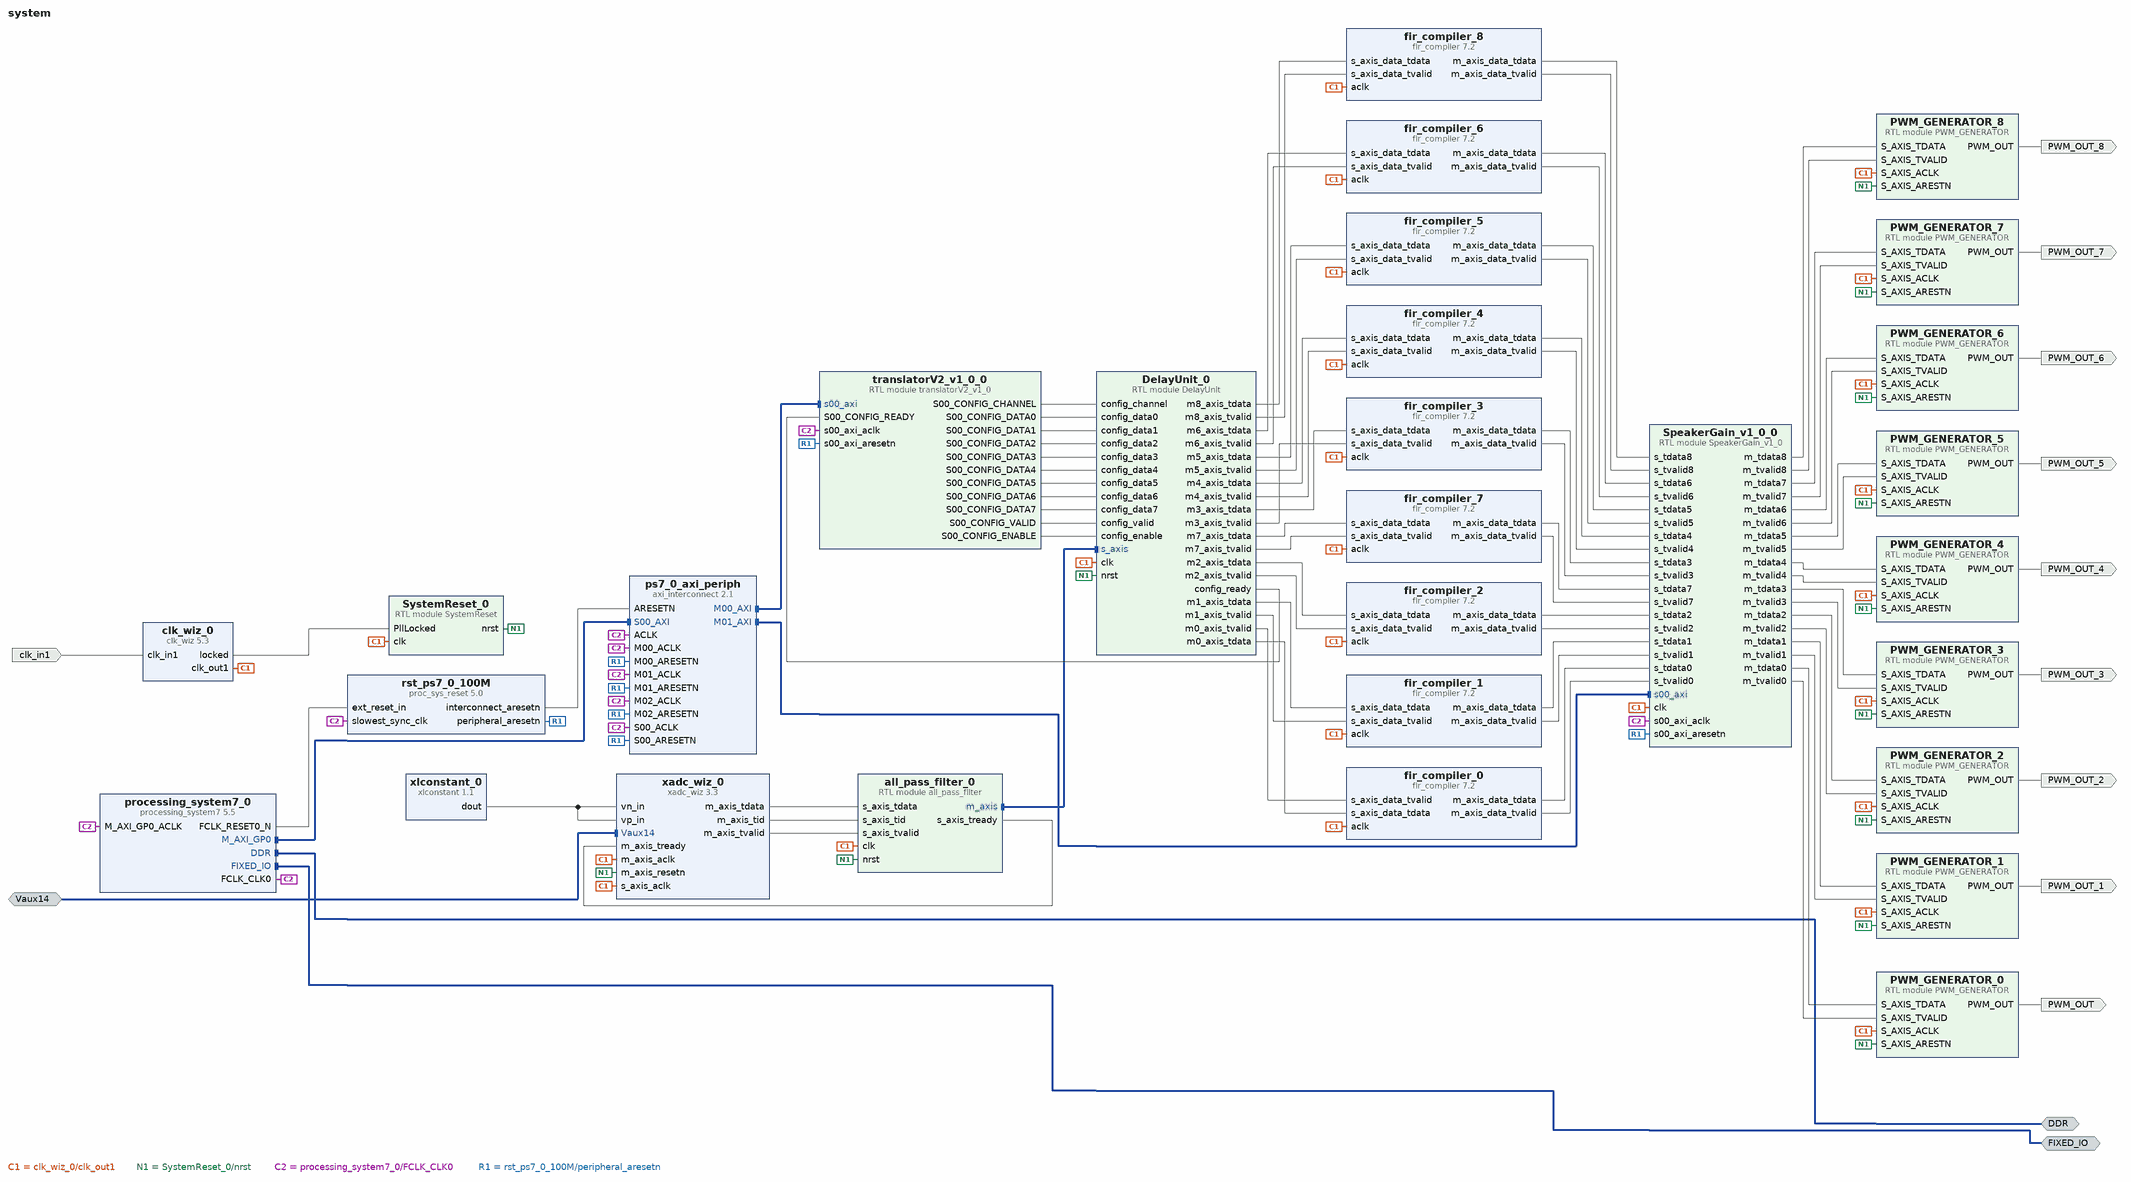
[diagram p0: block diagram of the top level]
# Vivado block design system, xc7z010clg400-1, Vivado 2016.4
create_bd_design system

create_bd_intf_port -mode Slave -vlnv xilinx.com:interface:diff_analog_io_rtl:1.0 Vaux14
create_bd_intf_port -mode Master -vlnv xilinx.com:interface:ddrx_rtl:1.0 DDR
create_bd_intf_port -mode Master -vlnv xilinx.com:display_processing_system7:fixedio_rtl:1.0 FIXED_IO
create_bd_port -dir I -type clk clk_in1
set_property -dict {CONFIG.FREQ_HZ 125000000} [get_bd_ports clk_in1]
create_bd_port -dir O PWM_OUT
create_bd_port -dir O PWM_OUT_1
create_bd_port -dir O PWM_OUT_2
create_bd_port -dir O PWM_OUT_3
create_bd_port -dir O PWM_OUT_4
create_bd_port -dir O PWM_OUT_5
create_bd_port -dir O PWM_OUT_6
create_bd_port -dir O PWM_OUT_7
create_bd_port -dir O PWM_OUT_8

create_bd_cell -type ip -vlnv xilinx.com:ip:xadc_wiz:3.3 xadc_wiz_0
set_property -dict [list \
  CONFIG.INTERFACE_SELECTION None \
  CONFIG.XADC_STARUP_SELECTION single_channel \
  CONFIG.DCLK_FREQUENCY 200 \
  CONFIG.ADC_CONVERSION_RATE 248 \
  CONFIG.SEQUENCER_MODE Off \
  CONFIG.ENABLE_CALIBRATION_AVERAGING false \
  CONFIG.ENABLE_RESET true \
  CONFIG.OT_ALARM false \
  CONFIG.USER_TEMP_ALARM false \
  CONFIG.VCCINT_ALARM false \
  CONFIG.VCCAUX_ALARM false \
  CONFIG.ENABLE_VCCPINT_ALARM false \
  CONFIG.ENABLE_VCCPAUX_ALARM false \
  CONFIG.ENABLE_VCCDDRO_ALARM false \
  CONFIG.SINGLE_CHANNEL_SELECTION VAUXP14_VAUXN14 \
  CONFIG.BIPOLAR_OPERATION false \
  CONFIG.SINGLE_CHANNEL_ACQUISITION_TIME false \
  CONFIG.ADC_OFFSET_AND_GAIN_CALIBRATION false \
  CONFIG.SENSOR_OFFSET_AND_GAIN_CALIBRATION false \
  CONFIG.EXTERNAL_MUX_CHANNEL VP_VN \
  CONFIG.ACQUISITION_TIME 4 \
  CONFIG.ENABLE_AXI4STREAM true \
] [get_bd_cells xadc_wiz_0]
create_bd_cell -type ip -vlnv xilinx.com:ip:clk_wiz:5.3 clk_wiz_0
set_property -dict [list \
  CONFIG.PRIMITIVE MMCM \
  CONFIG.USE_FREQ_SYNTH true \
  CONFIG.USE_PHASE_ALIGNMENT true \
  CONFIG.SECONDARY_SOURCE Single_ended_clock_capable_pin \
  CONFIG.CLKOUT1_REQUESTED_OUT_FREQ 200.000 \
  CONFIG.CLKOUT1_DRIVES BUFG \
  CONFIG.CLKOUT2_DRIVES BUFG \
  CONFIG.CLKOUT3_DRIVES BUFG \
  CONFIG.CLKOUT4_DRIVES BUFG \
  CONFIG.CLKOUT5_DRIVES BUFG \
  CONFIG.CLKOUT6_DRIVES BUFG \
  CONFIG.CLKOUT7_DRIVES BUFG \
  CONFIG.FEEDBACK_SOURCE FDBK_AUTO \
  CONFIG.USE_RESET false \
  CONFIG.OVERRIDE_MMCM false \
  CONFIG.MMCM_DIVCLK_DIVIDE 1 \
  CONFIG.MMCM_CLKFBOUT_MULT_F 8.000 \
  CONFIG.MMCM_CLKIN1_PERIOD 8.0 \
  CONFIG.MMCM_COMPENSATION ZHOLD \
  CONFIG.MMCM_CLKOUT0_DIVIDE_F 5.000 \
  CONFIG.CLKOUT1_JITTER 109.241 \
] [get_bd_cells clk_wiz_0]
create_bd_cell -type module -reference SystemReset SystemReset_0
create_bd_cell -type ip -vlnv xilinx.com:ip:xlconstant:1.1 xlconstant_0
create_bd_cell -type ip -vlnv xilinx.com:ip:fir_compiler:7.2 fir_compiler_1
set_property -dict [list \
  CONFIG.CoefficientVector {-0.000019041352741156416 0.0000029301914172371256 -3.6768483344507386e-7 -0.000003836551719568998 0.0000089002153275909 -0.000013674289108198891 0.00001687867604394857 -0.000017414023842576747 0.000014676634210476724 -0.000008795358390444727 7.128819105705863e-7 0.000007935685536875149 -0.000015143911555678856 0.000018994233996533387 -0.000018159172550968502 0.000012320896878708027 -0.000002381896379509973 -0.00000961278827549694 0.00002085069067935666 -0.000028375067438131785 0.00002982488349525296 -0.00002409549462988192 0.000011775667406554418 0.000004815964472440209 -0.000022017142099311243 0.000035602648801606694 -0.00004178881667839474 0.00003823817140914734 -0.000024804300939030065 0.0000038009191332509773 0.000020324054683538727 -0.00004188484963479359 0.00005526003825210053 -0.00005630910283599139 0.00004355618163140338 -0.00001882106383873046 -0.000012916540292147349 0.00004446020068207575 -0.00006798358521103809 0.00007692330651883338 -0.00006773262611607378 0.00004103870839226485 -0.0000018657423637850393 -0.00004122346939754801 0.00007794070152751594 -0.00009867798645794731 0.00009695074600652638 -0.0000712740123096432 0.00002595377645999454 0.00002949238856375895 -0.00008226028436258929 0.00011915525272199847 -0.00012982426630453567 0.00010954353145808946 -0.00006083592716046003 -0.000006577921938697168 0.00007761369495879302 -0.00013512636399127574 0.00016397831140467593 -0.00015492303020613014 0.00010732822916677011 -0.000029977455998076163 -0.000060389702304865136 0.00014260943181627756 -0.00019597233057583395 0.00020534581566300345 -0.0001652924648154562 0.00008209811231394558 0.000026943107875943244 -0.00013699642264337886 0.0002212563919353774 -0.0002573785668981639 0.0002332664572832073 -0.00015072856067744784 0.00002597552537061006 0.00011338200778125975 -0.00023433460933799656 0.00030619328717149287 -0.0003082472952060473 0.00023547945676466372 -0.00010080610094428376 -0.00006693052334588403 0.00022899293911600365 -0.0003455829437492202 0.0003854916247275692 -0.00033425274515994086 0.00019870910604078955 -0.000006658430774636147 -0.00019865526948053224 0.00036812077411889306 -0.00045842886639016017 0.00044290006258003705 -0.00031904194597501376 0.00011055520030152633 0.00013690183445902196 -0.0003655284207684386 0.0005187460956651649 -0.0005550450411802359 0.00045894329190607983 -0.00024623122381175046 -0.00003809196545489699 0.00032910643855402823 -0.0005566358186483607 0.0006620092212486477 -0.0006129490878703415 0.000412866742113862 -0.00010199446400902006 -0.00025038361038967014 0.0005611766143858198 -0.000752886866353166 0.0007727448729063266 -0.0006068037274486477 0.000285402152189655 0.00012186420381940452 -0.0005209502675615812 0.0008148830648118401 -0.000927111401184166 0.0008211132778651532 -0.0005113083051929379 0.00006217994826840372 0.00042478615163802166 -0.0008337961224003981 0.0010620594062415226 -0.0010453293884840442 0.0007753879505194565 -0.0003048332203720656 -0.00026261871449624515 0.0007946914764836736 -0.0011611358169578943 0.001265327944517681 -0.0010692865771081712 0.0006057168928571574 0.000026454030352946215 -0.0006827811996767003 0.0012060110963551744 -0.001463465580379262 0.0013802783639488365 -0.0009602480456305384 0.0002886719666866497 0.0004843764460821107 -0.0011772163823039593 0.0016189314187674752 -0.0016911405391928495 0.0013590476420805226 -0.0006837659311763557 -0.0001879366403568961 0.001055048470092471 -0.0017082830453966236 0.0019801847790092454 -0.00178746835249378 0.0011550154624745768 -0.00021488679690375242 -0.0008205604635378981 0.0017061639938962749 -0.0022215477806558125 0.0022253920315775558 -0.0016931423818874328 0.0007283117327795006 0.00045656720809545976 -0.0015861312278179077 0.0023856422122774156 -0.0026472043694480796 0.002282928601030838 -0.0013516370243227976 0.00005146471444394643 0.0013214224397132847 -0.002439616082358894 0.0030218574914216236 -0.002902896014769223 0.002078661821290235 -0.0007147483828981013 -0.0008855344708581879 0.002347723236253159 -0.003312984703577437 0.0035252018947944533 -0.0028974501488159957 0.001540921273714806 0.00025240314181401604 -0.0020713711716555602 0.003478833760551589 -0.004115557011655544 0.003790381411309153 -0.0025343796397941333 0.0006042660364119146 0.0015682223012447494 -0.003471446694985796 0.0046328698858826315 -0.004734607870994604 0.0036976715952429674 -0.0017131556686796991 -0.0007897654369456328 0.00323458754818787 -0.005028264031319931 0.005702795480762143 -0.005034312827249552 0.003110036006499024 -0.000324401561407994 -0.002698546280621569 0.005242307521669369 -0.006664316925323021 0.006554634985456841 -0.004847773456292042 0.00185889288891883 0.001768812358652028 -0.005198174297073603 0.007586561313611442 -0.00828738248289196 0.0070176106157153785 -0.003949538006207436 -0.00029973359509665945 0.004785183827492607 -0.00843656194118727 0.010304886403581508 -0.009797818712967612 0.006847933216103021 -0.001969729285972992 -0.00381599402551681 0.009182645210259754 -0.012786220998971368 0.013581726659228514 -0.011097099530066386 0.005598466976258024 0.0018998658268226426 -0.009796117828864628 0.016211116133106475 -0.019391983704541534 0.018129046529705935 -0.012096747430613189 0.002039067855966391 0.010252823544402932 -0.022183134769247614 0.030781921979053262 -0.0332506388488356 0.02752223341332959 -0.012726642971133252 -0.010534473584759027 0.04016715744605928 -0.07283552166567399 0.10444838811776436 -0.13080126193355354 0.14826105101766904 0.8356296512233774 0.14826105101766904 -0.13080126193355354 0.10444838811776436 -0.07283552166567399 0.04016715744605928 -0.010534473584759027 -0.012726642971133252 0.02752223341332959 -0.0332506388488356 0.030781921979053262 -0.022183134769247614 0.010252823544402932 0.002039067855966391 -0.012096747430613189 0.018129046529705935 -0.019391983704541534 0.016211116133106475 -0.009796117828864628 0.0018998658268226426 0.005598466976258024 -0.011097099530066386 0.013581726659228514 -0.012786220998971368 0.009182645210259754 -0.00381599402551681 -0.001969729285972992 0.006847933216103021 -0.009797818712967612 0.010304886403581508 -0.00843656194118727 0.004785183827492607 -0.00029973359509665945 -0.003949538006207436 0.0070176106157153785 -0.00828738248289196 0.007586561313611442 -0.005198174297073603 0.001768812358652028 0.00185889288891883 -0.004847773456292042 0.006554634985456841 -0.006664316925323021 0.005242307521669369 -0.002698546280621569 -0.000324401561407994 0.003110036006499024 -0.005034312827249552 0.005702795480762143 -0.005028264031319931 0.00323458754818787 -0.0007897654369456328 -0.0017131556686796991 0.0036976715952429674 -0.004734607870994604 0.0046328698858826315 -0.003471446694985796 0.0015682223012447494 0.0006042660364119146 -0.0025343796397941333 0.003790381411309153 -0.004115557011655544 0.003478833760551589 -0.0020713711716555602 0.00025240314181401604 0.001540921273714806 -0.0028974501488159957 0.0035252018947944533 -0.003312984703577437 0.002347723236253159 -0.0008855344708581879 -0.0007147483828981013 0.002078661821290235 -0.002902896014769223 0.0030218574914216236 -0.002439616082358894 0.0013214224397132847 0.00005146471444394643 -0.0013516370243227976 0.002282928601030838 -0.0026472043694480796 0.0023856422122774156 -0.0015861312278179077 0.00045656720809545976 0.0007283117327795006 -0.0016931423818874328 0.0022253920315775558 -0.0022215477806558125 0.0017061639938962749 -0.0008205604635378981 -0.00021488679690375242 0.0011550154624745768 -0.00178746835249378 0.0019801847790092454 -0.0017082830453966236 0.001055048470092471 -0.0001879366403568961 -0.0006837659311763557 0.0013590476420805226 -0.0016911405391928495 0.0016189314187674752 -0.0011772163823039593 0.0004843764460821107 0.0002886719666866497 -0.0009602480456305384 0.0013802783639488365 -0.001463465580379262 0.0012060110963551744 -0.0006827811996767003 0.000026454030352946215 0.0006057168928571574 -0.0010692865771081712 0.001265327944517681 -0.0011611358169578943 0.0007946914764836736 -0.00026261871449624515 -0.0003048332203720656 0.0007753879505194565 -0.0010453293884840442 0.0010620594062415226 -0.0008337961224003981 0.00042478615163802166 0.00006217994826840372 -0.0005113083051929379 0.0008211132778651532 -0.000927111401184166 0.0008148830648118401 -0.0005209502675615812 0.00012186420381940452 0.000285402152189655 -0.0006068037274486477 0.0007727448729063266 -0.000752886866353166 0.0005611766143858198 -0.00025038361038967014 -0.00010199446400902006 0.000412866742113862 -0.0006129490878703415 0.0006620092212486477 -0.0005566358186483607 0.00032910643855402823 -0.00003809196545489699 -0.00024623122381175046 0.00045894329190607983 -0.0005550450411802359 0.0005187460956651649 -0.0003655284207684386 0.00013690183445902196 0.00011055520030152633 -0.00031904194597501376 0.00044290006258003705 -0.00045842886639016017 0.00036812077411889306 -0.00019865526948053224 -0.000006658430774636147 0.00019870910604078955 -0.00033425274515994086 0.0003854916247275692 -0.0003455829437492202 0.00022899293911600365 -0.00006693052334588403 -0.00010080610094428376 0.00023547945676466372 -0.0003082472952060473 0.00030619328717149287 -0.00023433460933799656 0.00011338200778125975 0.00002597552537061006 -0.00015072856067744784 0.0002332664572832073 -0.0002573785668981639 0.0002212563919353774 -0.00013699642264337886 0.000026943107875943244 0.00008209811231394558 -0.0001652924648154562 0.00020534581566300345 -0.00019597233057583395 0.00014260943181627756 -0.000060389702304865136 -0.000029977455998076163 0.00010732822916677011 -0.00015492303020613014 0.00016397831140467593 -0.00013512636399127574 0.00007761369495879302 -0.000006577921938697168 -0.00006083592716046003 0.00010954353145808946 -0.00012982426630453567 0.00011915525272199847 -0.00008226028436258929 0.00002949238856375895 0.00002595377645999454 -0.0000712740123096432 0.00009695074600652638 -0.00009867798645794731 0.00007794070152751594 -0.00004122346939754801 -0.0000018657423637850393 0.00004103870839226485 -0.00006773262611607378 0.00007692330651883338 -0.00006798358521103809 0.00004446020068207575 -0.000012916540292147349 -0.00001882106383873046 0.00004355618163140338 -0.00005630910283599139 0.00005526003825210053 -0.00004188484963479359 0.000020324054683538727 0.0000038009191332509773 -0.000024804300939030065 0.00003823817140914734 -0.00004178881667839474 0.000035602648801606694 -0.000022017142099311243 0.000004815964472440209 0.000011775667406554418 -0.00002409549462988192 0.00002982488349525296 -0.000028375067438131785 0.00002085069067935666 -0.00000961278827549694 -0.000002381896379509973 0.000012320896878708027 -0.000018159172550968502 0.000018994233996533387 -0.000015143911555678856 0.000007935685536875149 7.128819105705863e-7 -0.000008795358390444727 0.000014676634210476724 -0.000017414023842576747 0.00001687867604394857 -0.000013674289108198891 0.0000089002153275909 -0.000003836551719568998 -3.6768483344507386e-7 0.0000029301914172371256 -0.000019041352741156416} \
  CONFIG.Coefficient_Sets 1 \
  CONFIG.Sample_Frequency 4.8E-2 \
  CONFIG.Clock_Frequency 200 \
  CONFIG.Coefficient_Sign Signed \
  CONFIG.Quantization Quantize_Only \
  CONFIG.Coefficient_Width 13 \
  CONFIG.Coefficient_Fractional_Bits 12 \
  CONFIG.Coefficient_Structure Inferred \
  CONFIG.Data_Sign Unsigned \
  CONFIG.Output_Rounding_Mode Non_Symmetric_Rounding_Down \
  CONFIG.Output_Width 16 \
  CONFIG.Filter_Architecture Systolic_Multiply_Accumulate \
  CONFIG.M_DATA_Has_TREADY false \
  CONFIG.S_DATA_Has_FIFO false \
] [get_bd_cells fir_compiler_1]
create_bd_cell -type ip -vlnv xilinx.com:ip:fir_compiler:7.2 fir_compiler_2
set_property -dict [list \
  CONFIG.CoefficientVector {-0.000019041352741156416 0.0000029301914172371256 -3.6768483344507386e-7 -0.000003836551719568998 0.0000089002153275909 -0.000013674289108198891 0.00001687867604394857 -0.000017414023842576747 0.000014676634210476724 -0.000008795358390444727 7.128819105705863e-7 0.000007935685536875149 -0.000015143911555678856 0.000018994233996533387 -0.000018159172550968502 0.000012320896878708027 -0.000002381896379509973 -0.00000961278827549694 0.00002085069067935666 -0.000028375067438131785 0.00002982488349525296 -0.00002409549462988192 0.000011775667406554418 0.000004815964472440209 -0.000022017142099311243 0.000035602648801606694 -0.00004178881667839474 0.00003823817140914734 -0.000024804300939030065 0.0000038009191332509773 0.000020324054683538727 -0.00004188484963479359 0.00005526003825210053 -0.00005630910283599139 0.00004355618163140338 -0.00001882106383873046 -0.000012916540292147349 0.00004446020068207575 -0.00006798358521103809 0.00007692330651883338 -0.00006773262611607378 0.00004103870839226485 -0.0000018657423637850393 -0.00004122346939754801 0.00007794070152751594 -0.00009867798645794731 0.00009695074600652638 -0.0000712740123096432 0.00002595377645999454 0.00002949238856375895 -0.00008226028436258929 0.00011915525272199847 -0.00012982426630453567 0.00010954353145808946 -0.00006083592716046003 -0.000006577921938697168 0.00007761369495879302 -0.00013512636399127574 0.00016397831140467593 -0.00015492303020613014 0.00010732822916677011 -0.000029977455998076163 -0.000060389702304865136 0.00014260943181627756 -0.00019597233057583395 0.00020534581566300345 -0.0001652924648154562 0.00008209811231394558 0.000026943107875943244 -0.00013699642264337886 0.0002212563919353774 -0.0002573785668981639 0.0002332664572832073 -0.00015072856067744784 0.00002597552537061006 0.00011338200778125975 -0.00023433460933799656 0.00030619328717149287 -0.0003082472952060473 0.00023547945676466372 -0.00010080610094428376 -0.00006693052334588403 0.00022899293911600365 -0.0003455829437492202 0.0003854916247275692 -0.00033425274515994086 0.00019870910604078955 -0.000006658430774636147 -0.00019865526948053224 0.00036812077411889306 -0.00045842886639016017 0.00044290006258003705 -0.00031904194597501376 0.00011055520030152633 0.00013690183445902196 -0.0003655284207684386 0.0005187460956651649 -0.0005550450411802359 0.00045894329190607983 -0.00024623122381175046 -0.00003809196545489699 0.00032910643855402823 -0.0005566358186483607 0.0006620092212486477 -0.0006129490878703415 0.000412866742113862 -0.00010199446400902006 -0.00025038361038967014 0.0005611766143858198 -0.000752886866353166 0.0007727448729063266 -0.0006068037274486477 0.000285402152189655 0.00012186420381940452 -0.0005209502675615812 0.0008148830648118401 -0.000927111401184166 0.0008211132778651532 -0.0005113083051929379 0.00006217994826840372 0.00042478615163802166 -0.0008337961224003981 0.0010620594062415226 -0.0010453293884840442 0.0007753879505194565 -0.0003048332203720656 -0.00026261871449624515 0.0007946914764836736 -0.0011611358169578943 0.001265327944517681 -0.0010692865771081712 0.0006057168928571574 0.000026454030352946215 -0.0006827811996767003 0.0012060110963551744 -0.001463465580379262 0.0013802783639488365 -0.0009602480456305384 0.0002886719666866497 0.0004843764460821107 -0.0011772163823039593 0.0016189314187674752 -0.0016911405391928495 0.0013590476420805226 -0.0006837659311763557 -0.0001879366403568961 0.001055048470092471 -0.0017082830453966236 0.0019801847790092454 -0.00178746835249378 0.0011550154624745768 -0.00021488679690375242 -0.0008205604635378981 0.0017061639938962749 -0.0022215477806558125 0.0022253920315775558 -0.0016931423818874328 0.0007283117327795006 0.00045656720809545976 -0.0015861312278179077 0.0023856422122774156 -0.0026472043694480796 0.002282928601030838 -0.0013516370243227976 0.00005146471444394643 0.0013214224397132847 -0.002439616082358894 0.0030218574914216236 -0.002902896014769223 0.002078661821290235 -0.0007147483828981013 -0.0008855344708581879 0.002347723236253159 -0.003312984703577437 0.0035252018947944533 -0.0028974501488159957 0.001540921273714806 0.00025240314181401604 -0.0020713711716555602 0.003478833760551589 -0.004115557011655544 0.003790381411309153 -0.0025343796397941333 0.0006042660364119146 0.0015682223012447494 -0.003471446694985796 0.0046328698858826315 -0.004734607870994604 0.0036976715952429674 -0.0017131556686796991 -0.0007897654369456328 0.00323458754818787 -0.005028264031319931 0.005702795480762143 -0.005034312827249552 0.003110036006499024 -0.000324401561407994 -0.002698546280621569 0.005242307521669369 -0.006664316925323021 0.006554634985456841 -0.004847773456292042 0.00185889288891883 0.001768812358652028 -0.005198174297073603 0.007586561313611442 -0.00828738248289196 0.0070176106157153785 -0.003949538006207436 -0.00029973359509665945 0.004785183827492607 -0.00843656194118727 0.010304886403581508 -0.009797818712967612 0.006847933216103021 -0.001969729285972992 -0.00381599402551681 0.009182645210259754 -0.012786220998971368 0.013581726659228514 -0.011097099530066386 0.005598466976258024 0.0018998658268226426 -0.009796117828864628 0.016211116133106475 -0.019391983704541534 0.018129046529705935 -0.012096747430613189 0.002039067855966391 0.010252823544402932 -0.022183134769247614 0.030781921979053262 -0.0332506388488356 0.02752223341332959 -0.012726642971133252 -0.010534473584759027 0.04016715744605928 -0.07283552166567399 0.10444838811776436 -0.13080126193355354 0.14826105101766904 0.8356296512233774 0.14826105101766904 -0.13080126193355354 0.10444838811776436 -0.07283552166567399 0.04016715744605928 -0.010534473584759027 -0.012726642971133252 0.02752223341332959 -0.0332506388488356 0.030781921979053262 -0.022183134769247614 0.010252823544402932 0.002039067855966391 -0.012096747430613189 0.018129046529705935 -0.019391983704541534 0.016211116133106475 -0.009796117828864628 0.0018998658268226426 0.005598466976258024 -0.011097099530066386 0.013581726659228514 -0.012786220998971368 0.009182645210259754 -0.00381599402551681 -0.001969729285972992 0.006847933216103021 -0.009797818712967612 0.010304886403581508 -0.00843656194118727 0.004785183827492607 -0.00029973359509665945 -0.003949538006207436 0.0070176106157153785 -0.00828738248289196 0.007586561313611442 -0.005198174297073603 0.001768812358652028 0.00185889288891883 -0.004847773456292042 0.006554634985456841 -0.006664316925323021 0.005242307521669369 -0.002698546280621569 -0.000324401561407994 0.003110036006499024 -0.005034312827249552 0.005702795480762143 -0.005028264031319931 0.00323458754818787 -0.0007897654369456328 -0.0017131556686796991 0.0036976715952429674 -0.004734607870994604 0.0046328698858826315 -0.003471446694985796 0.0015682223012447494 0.0006042660364119146 -0.0025343796397941333 0.003790381411309153 -0.004115557011655544 0.003478833760551589 -0.0020713711716555602 0.00025240314181401604 0.001540921273714806 -0.0028974501488159957 0.0035252018947944533 -0.003312984703577437 0.002347723236253159 -0.0008855344708581879 -0.0007147483828981013 0.002078661821290235 -0.002902896014769223 0.0030218574914216236 -0.002439616082358894 0.0013214224397132847 0.00005146471444394643 -0.0013516370243227976 0.002282928601030838 -0.0026472043694480796 0.0023856422122774156 -0.0015861312278179077 0.00045656720809545976 0.0007283117327795006 -0.0016931423818874328 0.0022253920315775558 -0.0022215477806558125 0.0017061639938962749 -0.0008205604635378981 -0.00021488679690375242 0.0011550154624745768 -0.00178746835249378 0.0019801847790092454 -0.0017082830453966236 0.001055048470092471 -0.0001879366403568961 -0.0006837659311763557 0.0013590476420805226 -0.0016911405391928495 0.0016189314187674752 -0.0011772163823039593 0.0004843764460821107 0.0002886719666866497 -0.0009602480456305384 0.0013802783639488365 -0.001463465580379262 0.0012060110963551744 -0.0006827811996767003 0.000026454030352946215 0.0006057168928571574 -0.0010692865771081712 0.001265327944517681 -0.0011611358169578943 0.0007946914764836736 -0.00026261871449624515 -0.0003048332203720656 0.0007753879505194565 -0.0010453293884840442 0.0010620594062415226 -0.0008337961224003981 0.00042478615163802166 0.00006217994826840372 -0.0005113083051929379 0.0008211132778651532 -0.000927111401184166 0.0008148830648118401 -0.0005209502675615812 0.00012186420381940452 0.000285402152189655 -0.0006068037274486477 0.0007727448729063266 -0.000752886866353166 0.0005611766143858198 -0.00025038361038967014 -0.00010199446400902006 0.000412866742113862 -0.0006129490878703415 0.0006620092212486477 -0.0005566358186483607 0.00032910643855402823 -0.00003809196545489699 -0.00024623122381175046 0.00045894329190607983 -0.0005550450411802359 0.0005187460956651649 -0.0003655284207684386 0.00013690183445902196 0.00011055520030152633 -0.00031904194597501376 0.00044290006258003705 -0.00045842886639016017 0.00036812077411889306 -0.00019865526948053224 -0.000006658430774636147 0.00019870910604078955 -0.00033425274515994086 0.0003854916247275692 -0.0003455829437492202 0.00022899293911600365 -0.00006693052334588403 -0.00010080610094428376 0.00023547945676466372 -0.0003082472952060473 0.00030619328717149287 -0.00023433460933799656 0.00011338200778125975 0.00002597552537061006 -0.00015072856067744784 0.0002332664572832073 -0.0002573785668981639 0.0002212563919353774 -0.00013699642264337886 0.000026943107875943244 0.00008209811231394558 -0.0001652924648154562 0.00020534581566300345 -0.00019597233057583395 0.00014260943181627756 -0.000060389702304865136 -0.000029977455998076163 0.00010732822916677011 -0.00015492303020613014 0.00016397831140467593 -0.00013512636399127574 0.00007761369495879302 -0.000006577921938697168 -0.00006083592716046003 0.00010954353145808946 -0.00012982426630453567 0.00011915525272199847 -0.00008226028436258929 0.00002949238856375895 0.00002595377645999454 -0.0000712740123096432 0.00009695074600652638 -0.00009867798645794731 0.00007794070152751594 -0.00004122346939754801 -0.0000018657423637850393 0.00004103870839226485 -0.00006773262611607378 0.00007692330651883338 -0.00006798358521103809 0.00004446020068207575 -0.000012916540292147349 -0.00001882106383873046 0.00004355618163140338 -0.00005630910283599139 0.00005526003825210053 -0.00004188484963479359 0.000020324054683538727 0.0000038009191332509773 -0.000024804300939030065 0.00003823817140914734 -0.00004178881667839474 0.000035602648801606694 -0.000022017142099311243 0.000004815964472440209 0.000011775667406554418 -0.00002409549462988192 0.00002982488349525296 -0.000028375067438131785 0.00002085069067935666 -0.00000961278827549694 -0.000002381896379509973 0.000012320896878708027 -0.000018159172550968502 0.000018994233996533387 -0.000015143911555678856 0.000007935685536875149 7.128819105705863e-7 -0.000008795358390444727 0.000014676634210476724 -0.000017414023842576747 0.00001687867604394857 -0.000013674289108198891 0.0000089002153275909 -0.000003836551719568998 -3.6768483344507386e-7 0.0000029301914172371256 -0.000019041352741156416} \
  CONFIG.Coefficient_Sets 1 \
  CONFIG.Sample_Frequency 4.8E-2 \
  CONFIG.Clock_Frequency 200 \
  CONFIG.Coefficient_Sign Signed \
  CONFIG.Quantization Quantize_Only \
  CONFIG.Coefficient_Width 13 \
  CONFIG.Coefficient_Fractional_Bits 12 \
  CONFIG.Coefficient_Structure Inferred \
  CONFIG.Data_Sign Unsigned \
  CONFIG.Output_Rounding_Mode Non_Symmetric_Rounding_Down \
  CONFIG.Output_Width 16 \
  CONFIG.Filter_Architecture Systolic_Multiply_Accumulate \
  CONFIG.S_DATA_Has_FIFO false \
] [get_bd_cells fir_compiler_2]
create_bd_cell -type ip -vlnv xilinx.com:ip:fir_compiler:7.2 fir_compiler_3
set_property -dict [list \
  CONFIG.CoefficientVector {-0.000019041352741156416 0.0000029301914172371256 -3.6768483344507386e-7 -0.000003836551719568998 0.0000089002153275909 -0.000013674289108198891 0.00001687867604394857 -0.000017414023842576747 0.000014676634210476724 -0.000008795358390444727 7.128819105705863e-7 0.000007935685536875149 -0.000015143911555678856 0.000018994233996533387 -0.000018159172550968502 0.000012320896878708027 -0.000002381896379509973 -0.00000961278827549694 0.00002085069067935666 -0.000028375067438131785 0.00002982488349525296 -0.00002409549462988192 0.000011775667406554418 0.000004815964472440209 -0.000022017142099311243 0.000035602648801606694 -0.00004178881667839474 0.00003823817140914734 -0.000024804300939030065 0.0000038009191332509773 0.000020324054683538727 -0.00004188484963479359 0.00005526003825210053 -0.00005630910283599139 0.00004355618163140338 -0.00001882106383873046 -0.000012916540292147349 0.00004446020068207575 -0.00006798358521103809 0.00007692330651883338 -0.00006773262611607378 0.00004103870839226485 -0.0000018657423637850393 -0.00004122346939754801 0.00007794070152751594 -0.00009867798645794731 0.00009695074600652638 -0.0000712740123096432 0.00002595377645999454 0.00002949238856375895 -0.00008226028436258929 0.00011915525272199847 -0.00012982426630453567 0.00010954353145808946 -0.00006083592716046003 -0.000006577921938697168 0.00007761369495879302 -0.00013512636399127574 0.00016397831140467593 -0.00015492303020613014 0.00010732822916677011 -0.000029977455998076163 -0.000060389702304865136 0.00014260943181627756 -0.00019597233057583395 0.00020534581566300345 -0.0001652924648154562 0.00008209811231394558 0.000026943107875943244 -0.00013699642264337886 0.0002212563919353774 -0.0002573785668981639 0.0002332664572832073 -0.00015072856067744784 0.00002597552537061006 0.00011338200778125975 -0.00023433460933799656 0.00030619328717149287 -0.0003082472952060473 0.00023547945676466372 -0.00010080610094428376 -0.00006693052334588403 0.00022899293911600365 -0.0003455829437492202 0.0003854916247275692 -0.00033425274515994086 0.00019870910604078955 -0.000006658430774636147 -0.00019865526948053224 0.00036812077411889306 -0.00045842886639016017 0.00044290006258003705 -0.00031904194597501376 0.00011055520030152633 0.00013690183445902196 -0.0003655284207684386 0.0005187460956651649 -0.0005550450411802359 0.00045894329190607983 -0.00024623122381175046 -0.00003809196545489699 0.00032910643855402823 -0.0005566358186483607 0.0006620092212486477 -0.0006129490878703415 0.000412866742113862 -0.00010199446400902006 -0.00025038361038967014 0.0005611766143858198 -0.000752886866353166 0.0007727448729063266 -0.0006068037274486477 0.000285402152189655 0.00012186420381940452 -0.0005209502675615812 0.0008148830648118401 -0.000927111401184166 0.0008211132778651532 -0.0005113083051929379 0.00006217994826840372 0.00042478615163802166 -0.0008337961224003981 0.0010620594062415226 -0.0010453293884840442 0.0007753879505194565 -0.0003048332203720656 -0.00026261871449624515 0.0007946914764836736 -0.0011611358169578943 0.001265327944517681 -0.0010692865771081712 0.0006057168928571574 0.000026454030352946215 -0.0006827811996767003 0.0012060110963551744 -0.001463465580379262 0.0013802783639488365 -0.0009602480456305384 0.0002886719666866497 0.0004843764460821107 -0.0011772163823039593 0.0016189314187674752 -0.0016911405391928495 0.0013590476420805226 -0.0006837659311763557 -0.0001879366403568961 0.001055048470092471 -0.0017082830453966236 0.0019801847790092454 -0.00178746835249378 0.0011550154624745768 -0.00021488679690375242 -0.0008205604635378981 0.0017061639938962749 -0.0022215477806558125 0.0022253920315775558 -0.0016931423818874328 0.0007283117327795006 0.00045656720809545976 -0.0015861312278179077 0.0023856422122774156 -0.0026472043694480796 0.002282928601030838 -0.0013516370243227976 0.00005146471444394643 0.0013214224397132847 -0.002439616082358894 0.0030218574914216236 -0.002902896014769223 0.002078661821290235 -0.0007147483828981013 -0.0008855344708581879 0.002347723236253159 -0.003312984703577437 0.0035252018947944533 -0.0028974501488159957 0.001540921273714806 0.00025240314181401604 -0.0020713711716555602 0.003478833760551589 -0.004115557011655544 0.003790381411309153 -0.0025343796397941333 0.0006042660364119146 0.0015682223012447494 -0.003471446694985796 0.0046328698858826315 -0.004734607870994604 0.0036976715952429674 -0.0017131556686796991 -0.0007897654369456328 0.00323458754818787 -0.005028264031319931 0.005702795480762143 -0.005034312827249552 0.003110036006499024 -0.000324401561407994 -0.002698546280621569 0.005242307521669369 -0.006664316925323021 0.006554634985456841 -0.004847773456292042 0.00185889288891883 0.001768812358652028 -0.005198174297073603 0.007586561313611442 -0.00828738248289196 0.0070176106157153785 -0.003949538006207436 -0.00029973359509665945 0.004785183827492607 -0.00843656194118727 0.010304886403581508 -0.009797818712967612 0.006847933216103021 -0.001969729285972992 -0.00381599402551681 0.009182645210259754 -0.012786220998971368 0.013581726659228514 -0.011097099530066386 0.005598466976258024 0.0018998658268226426 -0.009796117828864628 0.016211116133106475 -0.019391983704541534 0.018129046529705935 -0.012096747430613189 0.002039067855966391 0.010252823544402932 -0.022183134769247614 0.030781921979053262 -0.0332506388488356 0.02752223341332959 -0.012726642971133252 -0.010534473584759027 0.04016715744605928 -0.07283552166567399 0.10444838811776436 -0.13080126193355354 0.14826105101766904 0.8356296512233774 0.14826105101766904 -0.13080126193355354 0.10444838811776436 -0.07283552166567399 0.04016715744605928 -0.010534473584759027 -0.012726642971133252 0.02752223341332959 -0.0332506388488356 0.030781921979053262 -0.022183134769247614 0.010252823544402932 0.002039067855966391 -0.012096747430613189 0.018129046529705935 -0.019391983704541534 0.016211116133106475 -0.009796117828864628 0.0018998658268226426 0.005598466976258024 -0.011097099530066386 0.013581726659228514 -0.012786220998971368 0.009182645210259754 -0.00381599402551681 -0.001969729285972992 0.006847933216103021 -0.009797818712967612 0.010304886403581508 -0.00843656194118727 0.004785183827492607 -0.00029973359509665945 -0.003949538006207436 0.0070176106157153785 -0.00828738248289196 0.007586561313611442 -0.005198174297073603 0.001768812358652028 0.00185889288891883 -0.004847773456292042 0.006554634985456841 -0.006664316925323021 0.005242307521669369 -0.002698546280621569 -0.000324401561407994 0.003110036006499024 -0.005034312827249552 0.005702795480762143 -0.005028264031319931 0.00323458754818787 -0.0007897654369456328 -0.0017131556686796991 0.0036976715952429674 -0.004734607870994604 0.0046328698858826315 -0.003471446694985796 0.0015682223012447494 0.0006042660364119146 -0.0025343796397941333 0.003790381411309153 -0.004115557011655544 0.003478833760551589 -0.0020713711716555602 0.00025240314181401604 0.001540921273714806 -0.0028974501488159957 0.0035252018947944533 -0.003312984703577437 0.002347723236253159 -0.0008855344708581879 -0.0007147483828981013 0.002078661821290235 -0.002902896014769223 0.0030218574914216236 -0.002439616082358894 0.0013214224397132847 0.00005146471444394643 -0.0013516370243227976 0.002282928601030838 -0.0026472043694480796 0.0023856422122774156 -0.0015861312278179077 0.00045656720809545976 0.0007283117327795006 -0.0016931423818874328 0.0022253920315775558 -0.0022215477806558125 0.0017061639938962749 -0.0008205604635378981 -0.00021488679690375242 0.0011550154624745768 -0.00178746835249378 0.0019801847790092454 -0.0017082830453966236 0.001055048470092471 -0.0001879366403568961 -0.0006837659311763557 0.0013590476420805226 -0.0016911405391928495 0.0016189314187674752 -0.0011772163823039593 0.0004843764460821107 0.0002886719666866497 -0.0009602480456305384 0.0013802783639488365 -0.001463465580379262 0.0012060110963551744 -0.0006827811996767003 0.000026454030352946215 0.0006057168928571574 -0.0010692865771081712 0.001265327944517681 -0.0011611358169578943 0.0007946914764836736 -0.00026261871449624515 -0.0003048332203720656 0.0007753879505194565 -0.0010453293884840442 0.0010620594062415226 -0.0008337961224003981 0.00042478615163802166 0.00006217994826840372 -0.0005113083051929379 0.0008211132778651532 -0.000927111401184166 0.0008148830648118401 -0.0005209502675615812 0.00012186420381940452 0.000285402152189655 -0.0006068037274486477 0.0007727448729063266 -0.000752886866353166 0.0005611766143858198 -0.00025038361038967014 -0.00010199446400902006 0.000412866742113862 -0.0006129490878703415 0.0006620092212486477 -0.0005566358186483607 0.00032910643855402823 -0.00003809196545489699 -0.00024623122381175046 0.00045894329190607983 -0.0005550450411802359 0.0005187460956651649 -0.0003655284207684386 0.00013690183445902196 0.00011055520030152633 -0.00031904194597501376 0.00044290006258003705 -0.00045842886639016017 0.00036812077411889306 -0.00019865526948053224 -0.000006658430774636147 0.00019870910604078955 -0.00033425274515994086 0.0003854916247275692 -0.0003455829437492202 0.00022899293911600365 -0.00006693052334588403 -0.00010080610094428376 0.00023547945676466372 -0.0003082472952060473 0.00030619328717149287 -0.00023433460933799656 0.00011338200778125975 0.00002597552537061006 -0.00015072856067744784 0.0002332664572832073 -0.0002573785668981639 0.0002212563919353774 -0.00013699642264337886 0.000026943107875943244 0.00008209811231394558 -0.0001652924648154562 0.00020534581566300345 -0.00019597233057583395 0.00014260943181627756 -0.000060389702304865136 -0.000029977455998076163 0.00010732822916677011 -0.00015492303020613014 0.00016397831140467593 -0.00013512636399127574 0.00007761369495879302 -0.000006577921938697168 -0.00006083592716046003 0.00010954353145808946 -0.00012982426630453567 0.00011915525272199847 -0.00008226028436258929 0.00002949238856375895 0.00002595377645999454 -0.0000712740123096432 0.00009695074600652638 -0.00009867798645794731 0.00007794070152751594 -0.00004122346939754801 -0.0000018657423637850393 0.00004103870839226485 -0.00006773262611607378 0.00007692330651883338 -0.00006798358521103809 0.00004446020068207575 -0.000012916540292147349 -0.00001882106383873046 0.00004355618163140338 -0.00005630910283599139 0.00005526003825210053 -0.00004188484963479359 0.000020324054683538727 0.0000038009191332509773 -0.000024804300939030065 0.00003823817140914734 -0.00004178881667839474 0.000035602648801606694 -0.000022017142099311243 0.000004815964472440209 0.000011775667406554418 -0.00002409549462988192 0.00002982488349525296 -0.000028375067438131785 0.00002085069067935666 -0.00000961278827549694 -0.000002381896379509973 0.000012320896878708027 -0.000018159172550968502 0.000018994233996533387 -0.000015143911555678856 0.000007935685536875149 7.128819105705863e-7 -0.000008795358390444727 0.000014676634210476724 -0.000017414023842576747 0.00001687867604394857 -0.000013674289108198891 0.0000089002153275909 -0.000003836551719568998 -3.6768483344507386e-7 0.0000029301914172371256 -0.000019041352741156416} \
  CONFIG.Coefficient_Sets 1 \
  CONFIG.Sample_Frequency 4.8E-2 \
  CONFIG.Clock_Frequency 200 \
  CONFIG.Coefficient_Sign Signed \
  CONFIG.Quantization Quantize_Only \
  CONFIG.Coefficient_Width 13 \
  CONFIG.Coefficient_Fractional_Bits 12 \
  CONFIG.Coefficient_Structure Inferred \
  CONFIG.Data_Sign Unsigned \
  CONFIG.Output_Rounding_Mode Non_Symmetric_Rounding_Down \
  CONFIG.Output_Width 16 \
  CONFIG.Filter_Architecture Systolic_Multiply_Accumulate \
  CONFIG.S_DATA_Has_FIFO false \
] [get_bd_cells fir_compiler_3]
create_bd_cell -type ip -vlnv xilinx.com:ip:fir_compiler:7.2 fir_compiler_4
set_property -dict [list \
  CONFIG.CoefficientVector {-0.000019041352741156416 0.0000029301914172371256 -3.6768483344507386e-7 -0.000003836551719568998 0.0000089002153275909 -0.000013674289108198891 0.00001687867604394857 -0.000017414023842576747 0.000014676634210476724 -0.000008795358390444727 7.128819105705863e-7 0.000007935685536875149 -0.000015143911555678856 0.000018994233996533387 -0.000018159172550968502 0.000012320896878708027 -0.000002381896379509973 -0.00000961278827549694 0.00002085069067935666 -0.000028375067438131785 0.00002982488349525296 -0.00002409549462988192 0.000011775667406554418 0.000004815964472440209 -0.000022017142099311243 0.000035602648801606694 -0.00004178881667839474 0.00003823817140914734 -0.000024804300939030065 0.0000038009191332509773 0.000020324054683538727 -0.00004188484963479359 0.00005526003825210053 -0.00005630910283599139 0.00004355618163140338 -0.00001882106383873046 -0.000012916540292147349 0.00004446020068207575 -0.00006798358521103809 0.00007692330651883338 -0.00006773262611607378 0.00004103870839226485 -0.0000018657423637850393 -0.00004122346939754801 0.00007794070152751594 -0.00009867798645794731 0.00009695074600652638 -0.0000712740123096432 0.00002595377645999454 0.00002949238856375895 -0.00008226028436258929 0.00011915525272199847 -0.00012982426630453567 0.00010954353145808946 -0.00006083592716046003 -0.000006577921938697168 0.00007761369495879302 -0.00013512636399127574 0.00016397831140467593 -0.00015492303020613014 0.00010732822916677011 -0.000029977455998076163 -0.000060389702304865136 0.00014260943181627756 -0.00019597233057583395 0.00020534581566300345 -0.0001652924648154562 0.00008209811231394558 0.000026943107875943244 -0.00013699642264337886 0.0002212563919353774 -0.0002573785668981639 0.0002332664572832073 -0.00015072856067744784 0.00002597552537061006 0.00011338200778125975 -0.00023433460933799656 0.00030619328717149287 -0.0003082472952060473 0.00023547945676466372 -0.00010080610094428376 -0.00006693052334588403 0.00022899293911600365 -0.0003455829437492202 0.0003854916247275692 -0.00033425274515994086 0.00019870910604078955 -0.000006658430774636147 -0.00019865526948053224 0.00036812077411889306 -0.00045842886639016017 0.00044290006258003705 -0.00031904194597501376 0.00011055520030152633 0.00013690183445902196 -0.0003655284207684386 0.0005187460956651649 -0.0005550450411802359 0.00045894329190607983 -0.00024623122381175046 -0.00003809196545489699 0.00032910643855402823 -0.0005566358186483607 0.0006620092212486477 -0.0006129490878703415 0.000412866742113862 -0.00010199446400902006 -0.00025038361038967014 0.0005611766143858198 -0.000752886866353166 0.0007727448729063266 -0.0006068037274486477 0.000285402152189655 0.00012186420381940452 -0.0005209502675615812 0.0008148830648118401 -0.000927111401184166 0.0008211132778651532 -0.0005113083051929379 0.00006217994826840372 0.00042478615163802166 -0.0008337961224003981 0.0010620594062415226 -0.0010453293884840442 0.0007753879505194565 -0.0003048332203720656 -0.00026261871449624515 0.0007946914764836736 -0.0011611358169578943 0.001265327944517681 -0.0010692865771081712 0.0006057168928571574 0.000026454030352946215 -0.0006827811996767003 0.0012060110963551744 -0.001463465580379262 0.0013802783639488365 -0.0009602480456305384 0.0002886719666866497 0.0004843764460821107 -0.0011772163823039593 0.0016189314187674752 -0.0016911405391928495 0.0013590476420805226 -0.0006837659311763557 -0.0001879366403568961 0.001055048470092471 -0.0017082830453966236 0.0019801847790092454 -0.00178746835249378 0.0011550154624745768 -0.00021488679690375242 -0.0008205604635378981 0.0017061639938962749 -0.0022215477806558125 0.0022253920315775558 -0.0016931423818874328 0.0007283117327795006 0.00045656720809545976 -0.0015861312278179077 0.0023856422122774156 -0.0026472043694480796 0.002282928601030838 -0.0013516370243227976 0.00005146471444394643 0.0013214224397132847 -0.002439616082358894 0.0030218574914216236 -0.002902896014769223 0.002078661821290235 -0.0007147483828981013 -0.0008855344708581879 0.002347723236253159 -0.003312984703577437 0.0035252018947944533 -0.0028974501488159957 0.001540921273714806 0.00025240314181401604 -0.0020713711716555602 0.003478833760551589 -0.004115557011655544 0.003790381411309153 -0.0025343796397941333 0.0006042660364119146 0.0015682223012447494 -0.003471446694985796 0.0046328698858826315 -0.004734607870994604 0.0036976715952429674 -0.0017131556686796991 -0.0007897654369456328 0.00323458754818787 -0.005028264031319931 0.005702795480762143 -0.005034312827249552 0.003110036006499024 -0.000324401561407994 -0.002698546280621569 0.005242307521669369 -0.006664316925323021 0.006554634985456841 -0.004847773456292042 0.00185889288891883 0.001768812358652028 -0.005198174297073603 0.007586561313611442 -0.00828738248289196 0.0070176106157153785 -0.003949538006207436 -0.00029973359509665945 0.004785183827492607 -0.00843656194118727 0.010304886403581508 -0.009797818712967612 0.006847933216103021 -0.001969729285972992 -0.00381599402551681 0.009182645210259754 -0.012786220998971368 0.013581726659228514 -0.011097099530066386 0.005598466976258024 0.0018998658268226426 -0.009796117828864628 0.016211116133106475 -0.019391983704541534 0.018129046529705935 -0.012096747430613189 0.002039067855966391 0.010252823544402932 -0.022183134769247614 0.030781921979053262 -0.0332506388488356 0.02752223341332959 -0.012726642971133252 -0.010534473584759027 0.04016715744605928 -0.07283552166567399 0.10444838811776436 -0.13080126193355354 0.14826105101766904 0.8356296512233774 0.14826105101766904 -0.13080126193355354 0.10444838811776436 -0.07283552166567399 0.04016715744605928 -0.010534473584759027 -0.012726642971133252 0.02752223341332959 -0.0332506388488356 0.030781921979053262 -0.022183134769247614 0.010252823544402932 0.002039067855966391 -0.012096747430613189 0.018129046529705935 -0.019391983704541534 0.016211116133106475 -0.009796117828864628 0.0018998658268226426 0.005598466976258024 -0.011097099530066386 0.013581726659228514 -0.012786220998971368 0.009182645210259754 -0.00381599402551681 -0.001969729285972992 0.006847933216103021 -0.009797818712967612 0.010304886403581508 -0.00843656194118727 0.004785183827492607 -0.00029973359509665945 -0.003949538006207436 0.0070176106157153785 -0.00828738248289196 0.007586561313611442 -0.005198174297073603 0.001768812358652028 0.00185889288891883 -0.004847773456292042 0.006554634985456841 -0.006664316925323021 0.005242307521669369 -0.002698546280621569 -0.000324401561407994 0.003110036006499024 -0.005034312827249552 0.005702795480762143 -0.005028264031319931 0.00323458754818787 -0.0007897654369456328 -0.0017131556686796991 0.0036976715952429674 -0.004734607870994604 0.0046328698858826315 -0.003471446694985796 0.0015682223012447494 0.0006042660364119146 -0.0025343796397941333 0.003790381411309153 -0.004115557011655544 0.003478833760551589 -0.0020713711716555602 0.00025240314181401604 0.001540921273714806 -0.0028974501488159957 0.0035252018947944533 -0.003312984703577437 0.002347723236253159 -0.0008855344708581879 -0.0007147483828981013 0.002078661821290235 -0.002902896014769223 0.0030218574914216236 -0.002439616082358894 0.0013214224397132847 0.00005146471444394643 -0.0013516370243227976 0.002282928601030838 -0.0026472043694480796 0.0023856422122774156 -0.0015861312278179077 0.00045656720809545976 0.0007283117327795006 -0.0016931423818874328 0.0022253920315775558 -0.0022215477806558125 0.0017061639938962749 -0.0008205604635378981 -0.00021488679690375242 0.0011550154624745768 -0.00178746835249378 0.0019801847790092454 -0.0017082830453966236 0.001055048470092471 -0.0001879366403568961 -0.0006837659311763557 0.0013590476420805226 -0.0016911405391928495 0.0016189314187674752 -0.0011772163823039593 0.0004843764460821107 0.0002886719666866497 -0.0009602480456305384 0.0013802783639488365 -0.001463465580379262 0.0012060110963551744 -0.0006827811996767003 0.000026454030352946215 0.0006057168928571574 -0.0010692865771081712 0.001265327944517681 -0.0011611358169578943 0.0007946914764836736 -0.00026261871449624515 -0.0003048332203720656 0.0007753879505194565 -0.0010453293884840442 0.0010620594062415226 -0.0008337961224003981 0.00042478615163802166 0.00006217994826840372 -0.0005113083051929379 0.0008211132778651532 -0.000927111401184166 0.0008148830648118401 -0.0005209502675615812 0.00012186420381940452 0.000285402152189655 -0.0006068037274486477 0.0007727448729063266 -0.000752886866353166 0.0005611766143858198 -0.00025038361038967014 -0.00010199446400902006 0.000412866742113862 -0.0006129490878703415 0.0006620092212486477 -0.0005566358186483607 0.00032910643855402823 -0.00003809196545489699 -0.00024623122381175046 0.00045894329190607983 -0.0005550450411802359 0.0005187460956651649 -0.0003655284207684386 0.00013690183445902196 0.00011055520030152633 -0.00031904194597501376 0.00044290006258003705 -0.00045842886639016017 0.00036812077411889306 -0.00019865526948053224 -0.000006658430774636147 0.00019870910604078955 -0.00033425274515994086 0.0003854916247275692 -0.0003455829437492202 0.00022899293911600365 -0.00006693052334588403 -0.00010080610094428376 0.00023547945676466372 -0.0003082472952060473 0.00030619328717149287 -0.00023433460933799656 0.00011338200778125975 0.00002597552537061006 -0.00015072856067744784 0.0002332664572832073 -0.0002573785668981639 0.0002212563919353774 -0.00013699642264337886 0.000026943107875943244 0.00008209811231394558 -0.0001652924648154562 0.00020534581566300345 -0.00019597233057583395 0.00014260943181627756 -0.000060389702304865136 -0.000029977455998076163 0.00010732822916677011 -0.00015492303020613014 0.00016397831140467593 -0.00013512636399127574 0.00007761369495879302 -0.000006577921938697168 -0.00006083592716046003 0.00010954353145808946 -0.00012982426630453567 0.00011915525272199847 -0.00008226028436258929 0.00002949238856375895 0.00002595377645999454 -0.0000712740123096432 0.00009695074600652638 -0.00009867798645794731 0.00007794070152751594 -0.00004122346939754801 -0.0000018657423637850393 0.00004103870839226485 -0.00006773262611607378 0.00007692330651883338 -0.00006798358521103809 0.00004446020068207575 -0.000012916540292147349 -0.00001882106383873046 0.00004355618163140338 -0.00005630910283599139 0.00005526003825210053 -0.00004188484963479359 0.000020324054683538727 0.0000038009191332509773 -0.000024804300939030065 0.00003823817140914734 -0.00004178881667839474 0.000035602648801606694 -0.000022017142099311243 0.000004815964472440209 0.000011775667406554418 -0.00002409549462988192 0.00002982488349525296 -0.000028375067438131785 0.00002085069067935666 -0.00000961278827549694 -0.000002381896379509973 0.000012320896878708027 -0.000018159172550968502 0.000018994233996533387 -0.000015143911555678856 0.000007935685536875149 7.128819105705863e-7 -0.000008795358390444727 0.000014676634210476724 -0.000017414023842576747 0.00001687867604394857 -0.000013674289108198891 0.0000089002153275909 -0.000003836551719568998 -3.6768483344507386e-7 0.0000029301914172371256 -0.000019041352741156416} \
  CONFIG.Coefficient_Sets 1 \
  CONFIG.Sample_Frequency 4.8E-2 \
  CONFIG.Clock_Frequency 200 \
  CONFIG.Coefficient_Sign Signed \
  CONFIG.Quantization Quantize_Only \
  CONFIG.Coefficient_Width 13 \
  CONFIG.Coefficient_Fractional_Bits 12 \
  CONFIG.Coefficient_Structure Symmetric \
  CONFIG.Data_Sign Unsigned \
  CONFIG.Output_Rounding_Mode Non_Symmetric_Rounding_Down \
  CONFIG.Output_Width 16 \
  CONFIG.Filter_Architecture Systolic_Multiply_Accumulate \
  CONFIG.S_DATA_Has_FIFO false \
] [get_bd_cells fir_compiler_4]
create_bd_cell -type ip -vlnv xilinx.com:ip:fir_compiler:7.2 fir_compiler_5
